# EAGLE design PowerCircuit (EAGLE 9.6.2)
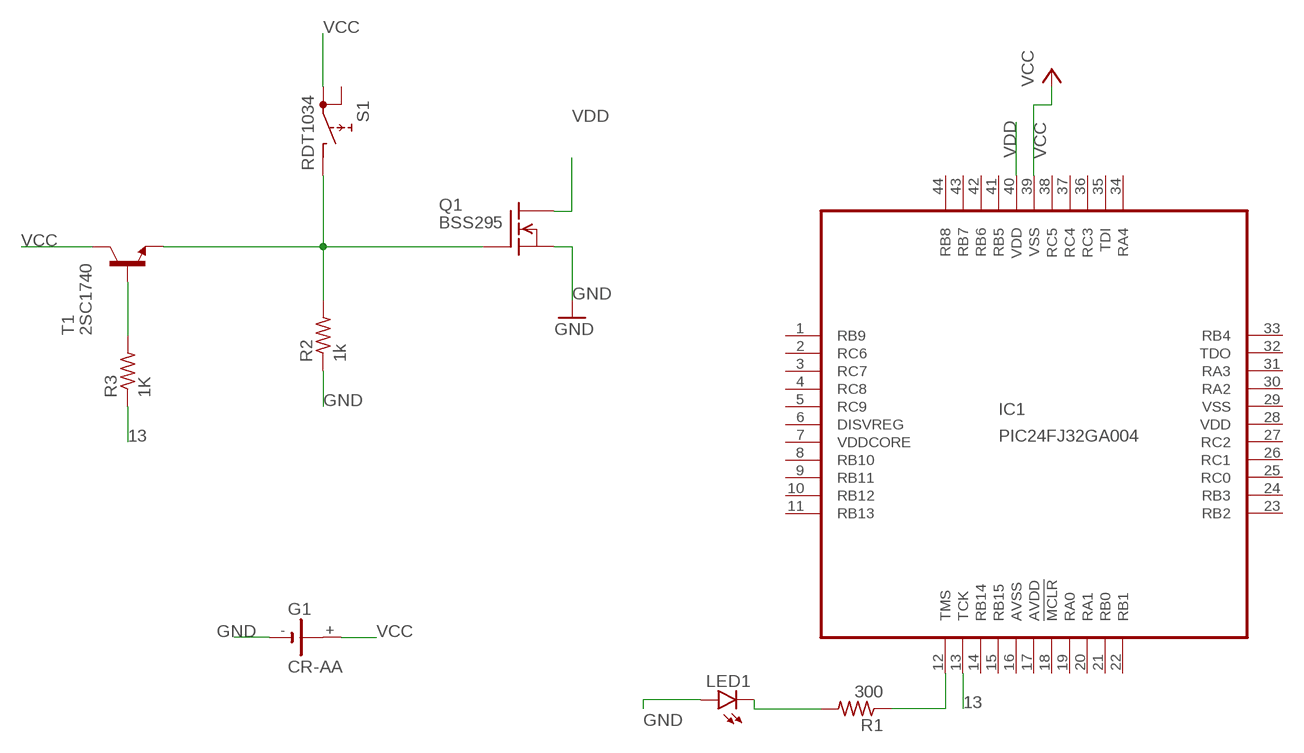
[diagram p0: schematic, sheet 1]

## Parts
G1  CR-AA  [CRAA]
IC1  PIC24FJ32GA004  [TQFP44]
LED1  LEDCHIPLED_1206  [CHIPLED_1206]
Q1  BSS295  [TO92]
R1  300  R-US_01005  [R01005]
R2  1k  R-US_01005  [R01005]
R3  1K  R-US_01005  [R01005]
S1  RDT1034  [RDT1034]
T1  2SC1740  [TO92-ECB]

## Nets
13: IC1.13(TCK) R3.1
GND: G1.- LED1.A Q1.3(S) R2.1
N$1: R3.2 T1.B
N$2: IC1.12(TMS) R1.1
N$3: Q1.1(G) R2.2 S1.B T1.E
N$4: LED1.C R1.2
VCC: G1.+ IC1.39(VSS) S1.A1 T1.C
VDD: IC1.40(VDD) Q1.2(D)
Unconnected: G1.+@1(+) IC1.1(RB9) IC1.2(RC6) IC1.3(RC7) IC1.4(RC8) IC1.5(RC9) IC1.6(DISVREG) IC1.8(RB10) IC1.9(RB11) IC1.10(RB12) IC1.11(RB13) IC1.14(RB14) IC1.15(RB15) IC1.18(!MCLR) IC1.19(RA0) IC1.20(RA1) IC1.21(RB0) IC1.22(RB1) IC1.23(RB2) IC1.24(RB3) IC1.25(RC0) IC1.26(RC1) IC1.27(RC2) IC1.30(RA2) IC1.31(RA3) IC1.32(TDO) IC1.33(RB4) IC1.34(RA4) IC1.35(TDI) IC1.36(RC3) IC1.37(RC4) IC1.38(RC5) IC1.41(RB5) IC1.42(RB6) IC1.43(RB7) IC1.44(RB8) S1.A

## Power pins joined to a net without a drawn wire
AVDD: IC1.17(AVDD)
AVSS: IC1.16(AVSS)
VDD: IC1.28(VDD)
VDDCORE: IC1.7(VDDCORE)
VSS: IC1.29(VSS)

## Library data of the parts
G1 = battery:CR-AA: LI BATTERY Varta CRAA-SLF
IC1 = microchip:PIC24FJ32GA004: PIC24FJ32GA004 edit this description Auto generated by make-symbol-device-package-bsdl.ulp Rev. 25 Source: PIC24FJ32GA004.bsd; MPN: PIC24FJ32GA004-E/PT; OC_FARNELL: 1332295; OC_NEWARK: 98M1915
LED1 = led:LED: LED OSRAM: - CHIPLED LG R971, LG N971, LY N971, LG Q971, LY Q971, LO R971, LY R971 LH N974, LH R974 LS Q976, LO Q976, LY Q976 LO Q996 - Hyper CHIPLED LW Q18S LB Q993, LB Q99A, LB R99A - SideLED LS A670, LO A670, LY A670, LG A670, LP A670 LB A673, LV A673, LT A673, LW A673 LH A674 LY A675 LS A676, LA A676, LO A676, LY A676, LW A676 LS A679, LY A679, LG A679 - Hyper Micro SIDELED® LS Y876, LA Y876, LO Y876, LY Y876 LT Y87S - SmartLED LW L88C, LW L88S LB L89C, LB L89S, LG L890 LS L89K, LO L89K, LY L89K LS L896, LA L896, LO L896, LY L896 - TOPLED LS T670, LO T670, LY T670, LG T670, LP T670 LSG T670, LSP T670, LSY T670, LOP T670, LYG T670 LG T671, LOG T671, LSG T671 LB T673, LV T673, LT T673, LW T673 LH T674 LS T676, LA T676, LO T676, LY T676, LB T676, LH T676, LSB T676, LW T676 LB T67C, LV T67C, LT T67C, LS T67K, LO T67K, LY T67K, LW E67C LS E67B, LA E67B, LO E67B, LY E67B, LB E67C, LV E67C, LT E67C LW T67C LS T679, LY T679, LG T679 LS T770, LO T770, LY T770, LG T770, LP T770 LB T773, LV T773, LT T773, LW T773 LH T774 LS E675, LA E675, LY E675, LS T675 LS T776, LA T776, LO T776, LY T776, LB T776 LHGB T686 LT T68C, LB T68C - Hyper Mini TOPLED® LB M676 - Mini TOPLED Santana® LG M470 LS M47K, LO M47K, LY M47K Source: http://www.osram.convergy.de LUXEON: - LUMILED® LXK2-PW12-R00, LXK2-PW12-S00, LXK2-PW14-U00, LXK2-PW14-V00 LXK2-PM12-R00, LXK2-PM12-S00, LXK2-PM14-U00 LXK2-PE12-Q00, LXK2-PE12-R00, LXK2-PE12-S00, LXK2-PE14-T00, LXK2-PE14-U00 LXK2-PB12-K00, LXK2-PB12-L00, LXK2-PB12-M00, LXK2-PB14-N00, LXK2-PB14-P00, LXK2-PB14-Q00 LXK2-PR12-L00, LXK2-PR12-M00, LXK2-PR14-Q00, LXK2-PR14-R00 LXK2-PD12-Q00, LXK2-PD12-R00, LXK2-PD12-S00 LXK2-PH12-R00, LXK2-PH12-S00 LXK2-PL12-P00, LXK2-PL12-Q00, LXK2-PL12-R00 Source: www.luxeon.com KINGBRIGHT: KA-3528ASYC Source: www.kingbright.com
Q1 = transistor-fet:BSS295: N-Channel Enhancement MOSFET not checked
R1-R3 = rcl:R-US_: RESISTOR, American symbol; SPICEPREFIX: R
S1 = switch:RDT1034: PUSH SWITCH www.radiohm.com
T1 = transistor:2SC1740: NPN Silicon Epitaxial Planar Transistor Source: SEMTECH ELECTRONICS LTD. 2SC1740.pdf

## Board
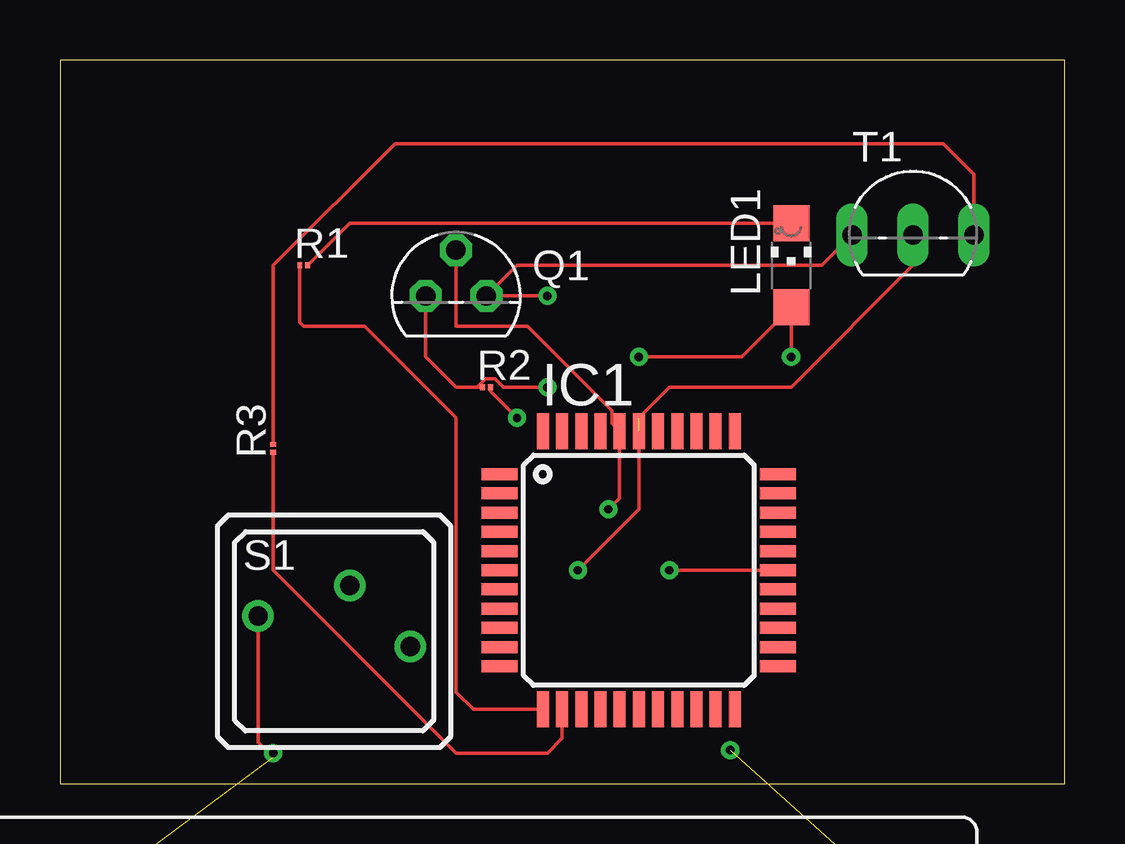
[diagram p1: board, top side]
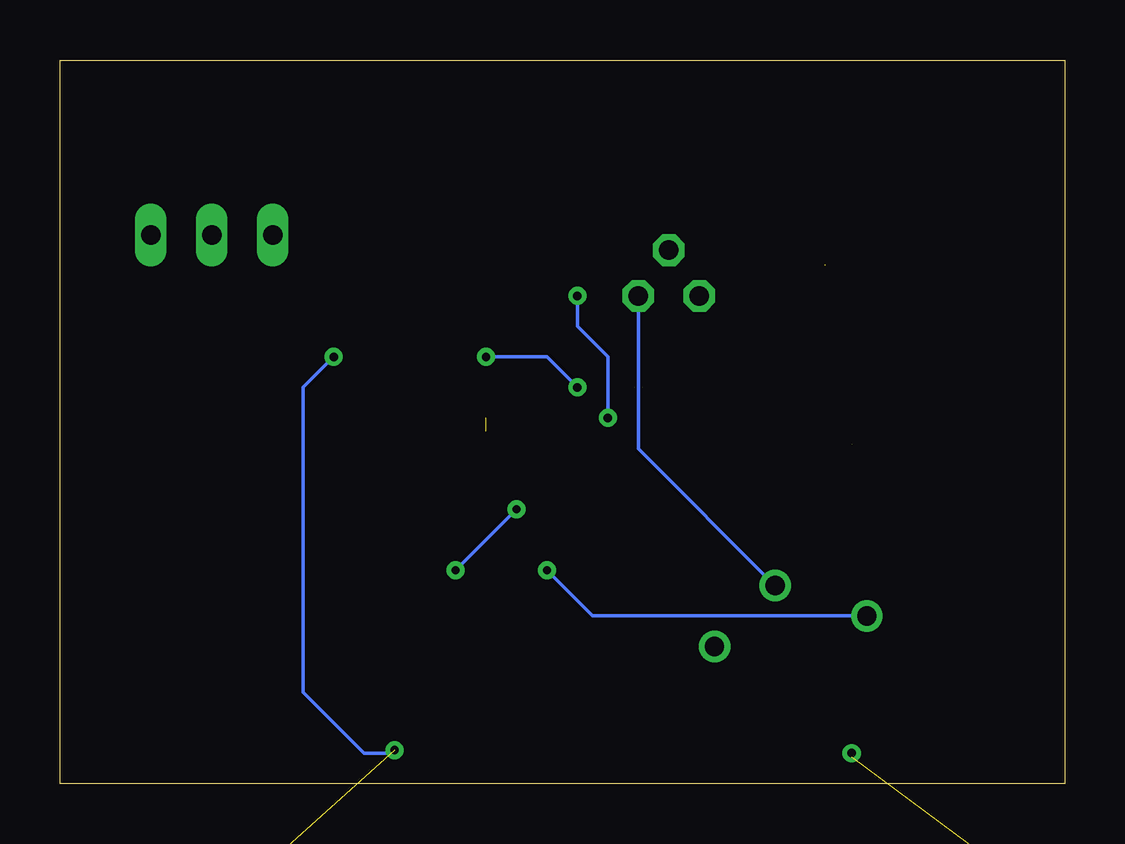
[diagram p2: board, bottom side, seen from below]

Size 41.89 x 30.15 mm. Coordinates in mm from the lower left corner, seen from the top.
Outline: 0,0 41.89,0 41.89,30.15 0,30.15 0,0
Copper layers (1*16): Top 0.035mm / dielectric 1.5mm / Bottom 0.035mm
Design rules "default": minimum track width 6mil, minimum drill 0.35mm, track to track 6mil, track to pad 6mil, pad to pad 6mil, via to via 6mil, smd to smd 6mil, copper to edge 40mil, drill to drill 6mil, minimum pad ring 10mil, minimum via ring 8mil, stop-mask expansion 4mil, vias tented up to drill 0mil, thermal gap 10mil

### Footprints (pad centres in the part's own frame; a part is rotated, then mirrored left to right if it is on the bottom)
CRAA = drill 1.321 pad 3.15 octagon: + -25.4,-5.08; +@1 -25.4,5.08; - 25.4,0
TQFP44 = smd 1.5 x 0.5: 1 -5.8,4; 2 -5.8,3.2; 3 -5.8,2.4; 4 -5.8,1.6; 5 -5.8,0.8; 6 -5.8,0; 7 -5.8,-0.8; 8 -5.8,-1.6; 9 -5.8,-2.4; 10 -5.8,-3.2; 11 -5.8,-4; 23 5.8,-4; 24 5.8,-3.2; 25 5.8,-2.4; 26 5.8,-1.6; 27 5.8,-0.8; 28 5.8,0; 29 5.8,0.8; 30 5.8,1.6; 31 5.8,2.4; 32 5.8,3.2; 33 5.8,4 | smd 0.5 x 1.5: 12 -4,-5.8; 13 -3.2,-5.8; 14 -2.4,-5.8; 15 -1.6,-5.8; 16 -0.8,-5.8; 17 0,-5.8; 18 0.8,-5.8; 19 1.6,-5.8; 20 2.4,-5.8; 21 3.2,-5.8; 22 4,-5.8; 34 4,5.8; 35 3.2,5.8; 36 2.4,5.8; 37 1.6,5.8; 38 0.8,5.8; 39 0,5.8; 40 -0.8,5.8; 41 -1.6,5.8; 42 -2.4,5.8; 43 -3.2,5.8; 44 -4,5.8
CHIPLED_1206 = smd 1.5 x 1.5: A 0,-1.75; C 0,1.75
TO92 = drill 0.813 octagon: 1 1.27,0; 2 0,1.905; 3 -1.27,0
R01005 = smd 0.2 x 0.25: 1 -0.163,0; 2 0.163,0
RDT1034 = drill 0.8: A 3.175,-0.635; A1 -3.175,0.635; B 0.65,1.9
TO92-ECB = drill 0.813 long: B 2.54,0; C 0,0; E -2.54,0

### Placement (x,y rotation side)
G1  13.97,-8.89 0 top  (outside the outline)
IC1  24.13,8.89 0 top
LED1  30.48,21.59 0 top
Q1  16.51,20.32 0 top
R1  10.16,21.59 0 top
R2  17.78,16.51 0 top
R3  8.89,13.97 90 top
S1  11.43,6.35 0 top
T1  35.56,22.86 0 top

### Tracks (layer width: path | path; a pad name or v marks a point on that pad's centre or on a via)
13
  Top 0.152: IC1.13 20.93,1.88 20.32,1.27 16.51,1.27 8.89,8.89 R3.1
GND  (via drill 0.35)  (2 unrouted)
  Top 0.152: Q1.3 15.24,17.78 16.51,16.51 17.39,16.51 | R2.1 17.39,16.51 | v24.13,17.78 28.42,17.78 LED1.A v30.48,17.78 | v20.32,16.51 18.49,16.51 18.14,16.86 17.75,16.86 17.39,16.51
  Bottom 0.152: v24.13,17.78 21.59,17.78 v20.32,16.51 | v30.48,17.78 31.75,16.51 31.75,3.81 29.21,1.27 28.06,1.27 v27.94,1.39
N$1  (1 unrouted)
  Top 0.152: T1.B 38.1,25.4 36.83,26.67 13.97,26.67 8.89,21.59 R3.2
N$2  (1 unrouted)
  Top 0.152: IC1.12 17.23,3.09 16.51,3.81 16.51,15.24 12.7,19.05 10.16,19.05 9.99,19.22 R1.1
N$3  (via drill 0.35)  (1 unrouted)
  Top 0.152: T1.E 31.75,21.59 19.05,21.59 Q1.1 v20.32,20.32 | v19.05,15.24 17.95,16.34 R2.2
  Bottom 0.152: Q1.1 17.78,13.95 S1.B | v20.32,20.32 20.32,19.05 19.05,17.78 v19.05,15.24
N$4
  Top 0.152: R1.2 12.07,23.34 LED1.C
N$5  (via drill 0.35)
  other vias: 8.89,1.27
VCC  (via drill 0.35)  (2 unrouted)
  Top 0.152: T1.C 35.56,21.59 30.48,16.51 25.4,16.51 24.13,15.24 | v21.59,8.89 24.13,11.43 IC1.39 | S1.A1 8.26,1.73 8.89,1.09
  Bottom 0.152: S1.A1 19.68,6.99 v21.59,8.89
VDD  (via drill 0.35)
  Top 0.152: Q1.2 16.51,19.05 19.49,19.05 23.01,15.54 23.01,15.01 IC1.40 23.33,11.9 v22.86,11.43 | v25.4,8.89 IC1.28
  Bottom 0.152: v22.86,11.43 v25.4,8.89